# Altium schematic sheet InputConnector.SchDoc: Input Connector
size Letter; Engineer: Brandt Buchda & Patrick Nowakowski; Revision: C; SheetTotal: 4; SheetNumber: 1
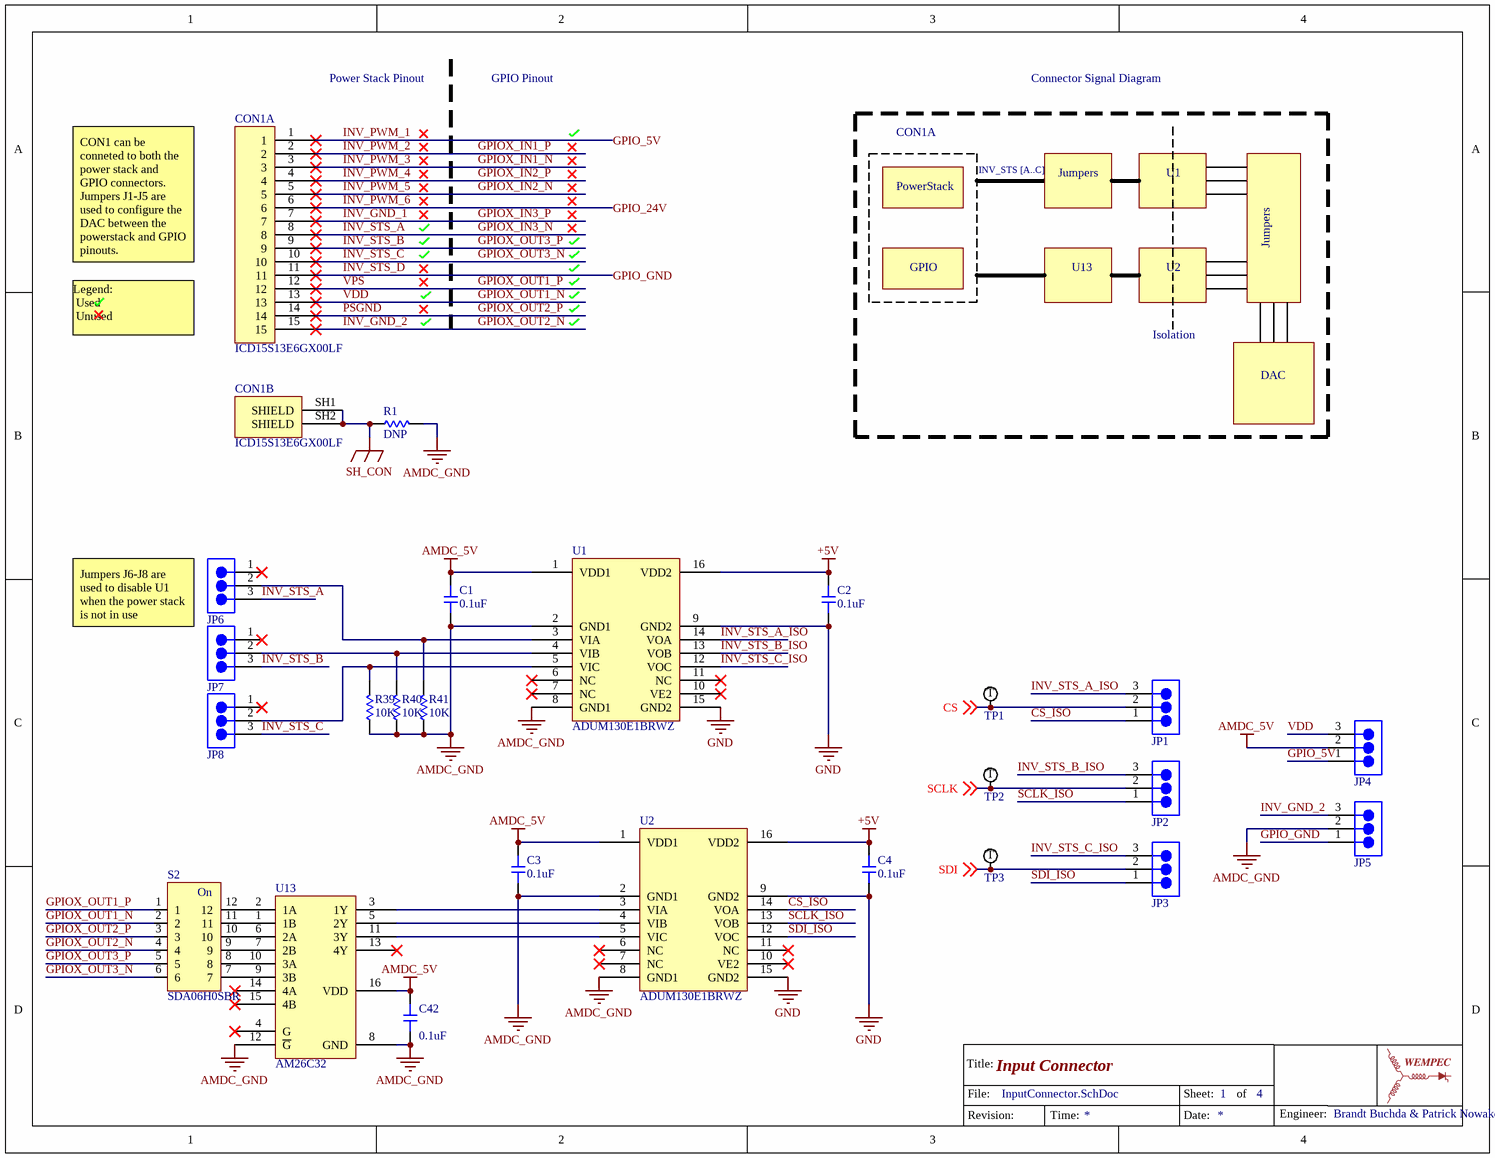
[diagram p0: InputConnector.SchDoc]

## Parts
C1  value 0.1uF  [0603-CAP]  (hidden comment: CC0603KRX7R8BB104)
C2  value 0.1uF  [0603-CAP]  (hidden comment: CC0603KRX7R8BB104)
C3  value 0.1uF  [0603-CAP]  (hidden comment: CC0603KRX7R8BB104)
C4  value 0.1uF  [0603-CAP]  (hidden comment: CC0603KRX7R8BB104)
C42  value 0.1uF  [0603-CAP]  (hidden comment: CC0603KRX7R8BB104)
CON1  ICD15S13E6GX00LF  [ICD15S13E6GX00LF]  (parts A,B of 2)
JP1  TSW-103-07-F-S  [PIN_HEADER_1X3]  (value not drawn)
JP2  TSW-103-07-F-S  [PIN_HEADER_1X3]  (value not drawn)
JP3  TSW-103-07-F-S  [PIN_HEADER_1X3]  (value not drawn)
JP4  TSW-103-07-F-S  [PIN_HEADER_1X3]  (value not drawn)
JP5  TSW-103-07-F-S  [PIN_HEADER_1X3]  (value not drawn)
JP6  TSW-103-07-F-S  [PIN_HEADER_1X3]  (value not drawn)
JP7  TSW-103-07-F-S  [PIN_HEADER_1X3]  (value not drawn)
JP8  TSW-103-07-F-S  [PIN_HEADER_1X3]  (value not drawn)
R1  value DNP  [0603-RES]  (hidden comment: Resistor)  (no BOM)
R39  value 10K  [0603-RES]  (hidden comment: ERJ-PB3B1002V)
R40  value 10K  [0603-RES]  (hidden comment: ERJ-PB3B1002V)
R41  value 10K  [0603-RES]  (hidden comment: ERJ-PB3B1002V)
S2  SDA06H0SBR  [SDA06H0SBR]
TP1  Test Point  [RCU-0C]  (value not drawn)
TP2  Test Point  [RCU-0C]  (value not drawn)
TP3  Test Point  [RCU-0C]  (value not drawn)
U1  ADUM130E1BRWZ  [SOIC127P1030X265-16N]
U2  ADUM130E1BRWZ  [SOIC127P1030X265-16N]
U13  AM26C32  [TSOP65P640X120-16N]

## Nets
+5V: C2.2 C4.2 U1.16(VDD2) U2.16(VDD2)
AMDC_5V: C1.2 C3.2 C42.2 JP4.2 U1.1(VDD1) U2.1(VDD1) U13.16(VDD)
AMDC_GND: C1.1 C3.1 C42.1 JP5.2 R1.2 R39.1 R40.1 R41.1 U1.2(GND1) U1.8(GND1) U2.2(GND1) U2.8(GND1) U13.8(GND) U13.12(~{G})
GND: C2.1 C4.1 U1.9(GND2) U1.15(GND2) U2.9(GND2) U2.15(GND2)
SH_CON: CON1.SH1(SHIELD) CON1.SH2(SHIELD) R1.1
CS: JP1.2 TP1.1 ; off-sheet CS
CS_ISO: JP1.1 U2.14(VOA)
GPIO_5V: CON1.1 JP4.1  [also labelled INV_PWM_1]
GPIO_24V: CON1.6  [also labelled INV_PWM_6]
GPIO_GND: CON1.11 JP5.1  [also labelled INV_STS_D]
GPIOX_IN1_N: CON1.3  [also labelled INV_PWM_3]
GPIOX_IN1_P: CON1.2  [also labelled INV_PWM_2]
GPIOX_IN2_N: CON1.5  [also labelled INV_PWM_5]
GPIOX_IN2_P: CON1.4  [also labelled INV_PWM_4]
GPIOX_IN3_N: CON1.8 JP6.3  [also labelled INV_STS_A]
GPIOX_IN3_P: CON1.7  [also labelled INV_GND_1]
GPIOX_OUT1_N: CON1.13 JP4.3 S2.2  [also labelled VDD]
GPIOX_OUT1_P: CON1.12 S2.1  [also labelled VPS]
GPIOX_OUT2_N: CON1.15 JP5.3 S2.4  [also labelled INV_GND_2]
GPIOX_OUT2_P: CON1.14 S2.3  [also labelled PSGND]
GPIOX_OUT3_N: CON1.10 JP8.3 S2.6  [also labelled INV_STS_C]
GPIOX_OUT3_P: CON1.9 JP7.3 S2.5  [also labelled INV_STS_B]
INV_STS_A_ISO: JP1.3 U1.14(VOA)
INV_STS_B_ISO: JP2.3 U1.13(VOB)
INV_STS_C_ISO: JP3.3 U1.12(VOC)
SCLK: JP2.2 TP2.1 ; off-sheet SCLK
SCLK_ISO: JP2.1 U2.13(VOB)
SDI: JP3.2 TP3.1 ; off-sheet SDI
SDI_ISO: JP3.1 U2.12(VOC)
NetJP6_2: JP6.2 R41.2 U1.3(VIA)
NetJP7_2: JP7.2 R40.2 U1.4(VIB)
NetJP8_2: JP8.2 R39.2 U1.5(VIC)
NetS2_7: S2.7 U13.9(3B)
NetS2_8: S2.8 U13.10(3A)
NetS2_9: S2.9 U13.7(2B)
NetS2_10: S2.10 U13.6(2A)
NetS2_11: S2.11 U13.1(1B)
NetS2_12: S2.12 U13.2(1A)
NetU2_3: U2.3(VIA) U13.3(1Y)
NetU2_4: U2.4(VIB) U13.5(2Y)
NetU2_5: U2.5(VIC) U13.11(3Y)

Not connected (* = marked no-connect by the designer): JP6 1(76)*; JP7 1(76)*; JP8 1(76)*; U1 6(NC)* 7(NC)* 10(VE2)* 11(NC)*; U2 6(NC)* 7(NC)* 10(VE2)* 11(NC)*; U13 4(G)* 13(4Y)* 14(4A)* 15(4B)*

## Notes on the sheet
- Power Stack Pinout
- GPIO Pinout
- Connector Signal Diagram
- CON1A
- PowerStack
- INV_STS [A..C]
- Jumpers
- U1
- CON1 can be conneted to both the power stack and GPIO connectors. Jumpers J1-J5 are used to configure the DAC between the powerstack and GPIO pinouts.
- GPIO
- U13
- U2
- Legend:
  Used
  Unused
- Isolation
- DAC
- Jumpers J6-J8 are used to disable U1 when the power stack is not in use
- Title:
- File:
- Sheet:
- of
- Revision:
- Time:
- Date:
- Engineer:
- (in symbol SDA06H0SBR) On
- (in symbol Test Point) T

## Library data of the parts
C1-C4 C42 = Capacitor 0.1uF: 0.1µF ±10% 25V Ceramic Capacitor X7R 0603 (1608 Metric); Supplier 1: Digi-Key; Supplier Part Number 1: 311-1341-1-ND
CON1 = ICD15S13E6GX00LF: 15 Position D-Sub, High Density Receptacle, Female Sockets Connector; Supplier Part Number 1: 609-2801-ND; Supplier 1: Digi-Key
JP1-JP8 = TSW-103-07-F-S: Connector Header Through Hole 3 position 0.100" (2.54mm); Supplier 1: Digi-Key; Supplier Part Number 1: SAM8995-ND
R1 = Resistor: DNP; Supplier 1: Digi-Key
R39-R41 = Resistor 10K: 10 kOhms ±0.1% 0.2W, 1/5W Chip Resistor 0603 (1608 Metric) Automotive AEC-Q200, Pulse Withstanding Thick Film; Supplier 1: Digi-Key; Supplier Part Number 1: P20086CT-ND
S2 = SDA06H0SBR: SWITCH SLIDE DIP SPST 25MA 24V; Supplier 1: Digi-Key; Supplier Part Number 1: CKN9495CT-ND
TP1-TP3 = Test Point: Material - Insulation: No Insulation; Supplier Part Number: *; Supplier: *; Footprint: *; Supplier 1: Digi-Key; RoHS: RoHS Compliant; Category: Test and Measurement; Stock 1: 136646; Pricing 1: 1=0.22, 10=0.206, 25=0.1756, 50=0.1536, 100=0.1426, 250=0.12616, 500=0.12068, 1000=0.09874 (USD); Packaging: Cut Tape (CT); Part Status: Active; Type: PC Test Point; Mounting Type: Surface Mount; Color: Natural; Size / Dimension: 0.063" x 0.031" x 0.045" (1.60mm x 0.80mm x 1.15mm); Plating: -; Material - Body: -; ComponentLink1URL: http://www.te.com/commerce/DocumentDelivery/DDEController?Action=srchrtrv&DocNm=1773266&DocType=DS&DocLang=English; ComponentLink1Description: http://www.te.com/commerce/DocumentDelivery/DDEController?Action=srchrtrv&DocNm=1773266&DocType=DS&DocLang=English; Supplier Part Number 1: A106145CT-ND
U1 U2 = ADUM130E1BRWZ: General Purpose Digital Isolator 3750Vrms 3 Channel 150Mbps 75kV/µs CMTI 16-SOIC (0.295", 7.50mm Width); Supplier 1: Digi-Key; Supplier Part Number 1: ADUM130E1BRWZ-ND
U13 = AM26C32: IC RCVR RS422 QUAD DIFF 16TSSOP; Supplier 1: Digi-Key; Supplier Part Number 1: 296-30088-1-ND